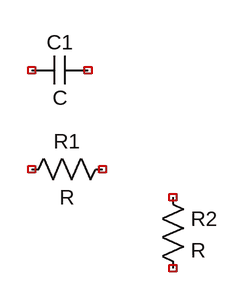
[diagram p0: schematic umbilical_boost.asc]
umbilical_boost.asc, the LTspice schematic file:
Version 4
SHEET 1 880 680
SYMBOL cap 144 144 R270
WINDOW 0 32 32 VTop 0
WINDOW 3 0 32 VBottom 0
SYMATTR InstName C1
SYMBOL res 128 256 R270
WINDOW 0 32 56 VTop 0
WINDOW 3 0 56 VBottom 0
SYMATTR InstName R1
SYMBOL res 288 256 R0
SYMATTR InstName R2

The netlist it stands for:
* umbilical_boost.asc
C1 NC_01 NC_02 C
R1 NC_03 NC_04 R
R2 NC_05 NC_06 R
.backanno
.end